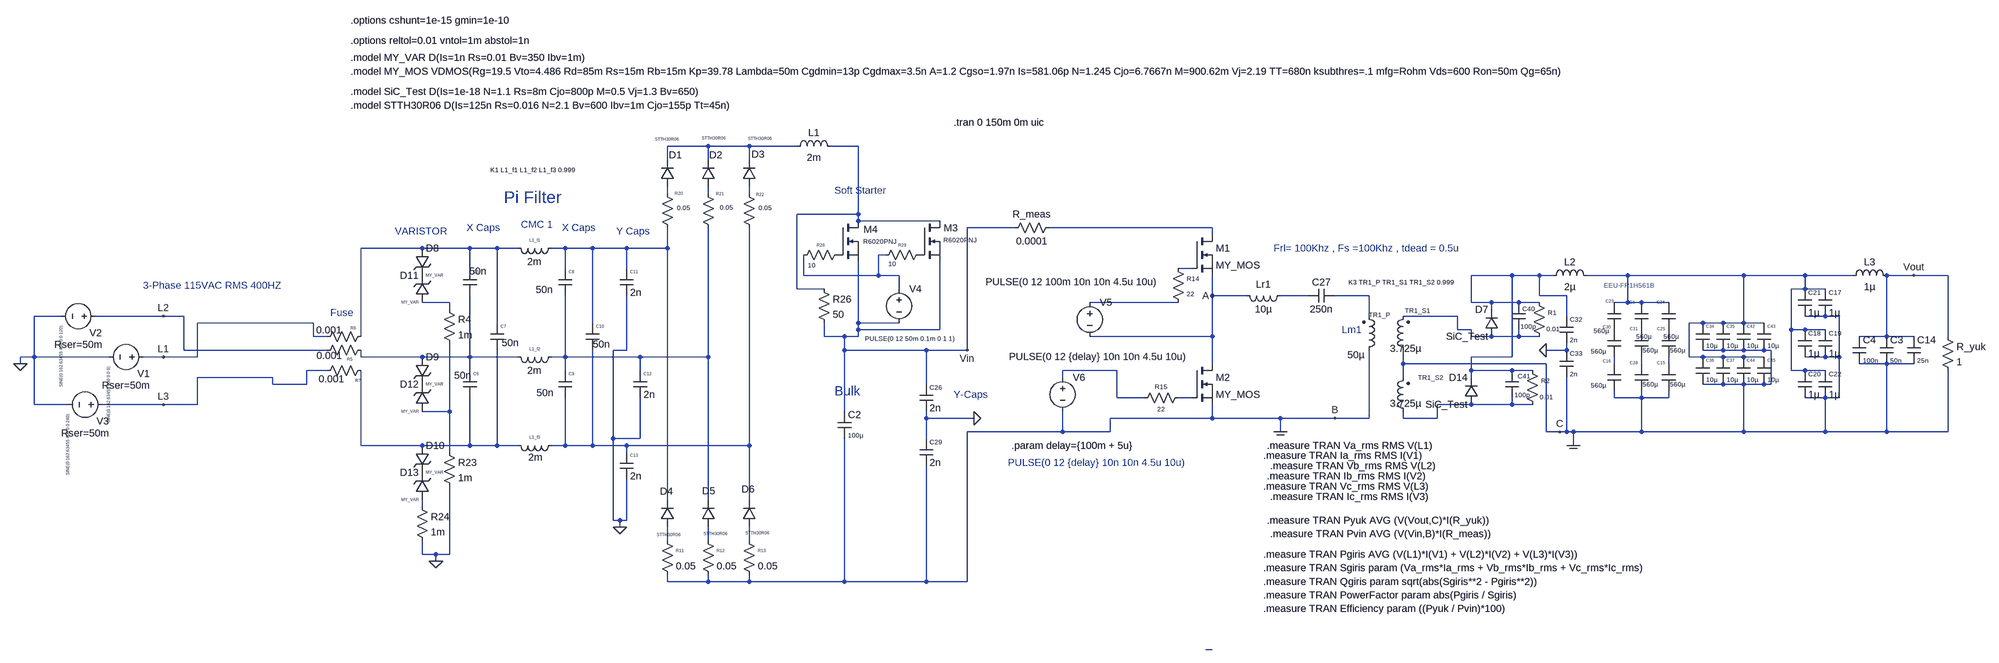
[diagram p0: schematic Sim.asc]
Sim.asc, the LTspice schematic file:
Version 4.1
SHEET 1 5288 1360
WIRE 1616 -672 1520 -672
WIRE 1712 -672 1616 -672
WIRE 1824 -672 1712 -672
WIRE 1968 -672 1904 -672
WIRE 1520 -640 1520 -672
WIRE 1616 -640 1616 -672
WIRE 1712 -640 1712 -672
WIRE 1520 -560 1520 -576
WIRE 1616 -560 1616 -576
WIRE 1712 -560 1712 -576
WIRE 1968 -512 1968 -672
WIRE 1968 -512 1824 -512
WIRE 1968 -496 1968 -512
WIRE 2160 -496 1968 -496
WIRE 2336 -480 2224 -480
WIRE 2800 -480 2416 -480
WIRE 2800 -464 2800 -480
WIRE 944 -432 800 -432
WIRE 1056 -432 944 -432
WIRE 1120 -432 1056 -432
WIRE 1168 -432 1120 -432
WIRE 1280 -432 1248 -432
WIRE 1344 -432 1280 -432
WIRE 1424 -432 1344 -432
WIRE 1520 -432 1520 -480
WIRE 1520 -432 1424 -432
WIRE 2032 -416 2016 -416
WIRE 1056 -384 1056 -432
WIRE 1280 -384 1280 -432
WIRE 1424 -384 1424 -432
WIRE 2752 -384 2720 -384
WIRE 1840 -368 1840 -416
WIRE 2016 -368 2016 -416
WIRE 2016 -368 1840 -368
WIRE 2064 -368 2016 -368
WIRE 3504 -368 3408 -368
WIRE 3568 -368 3504 -368
WIRE 3600 -368 3568 -368
WIRE 3776 -368 3680 -368
WIRE 4048 -368 3776 -368
WIRE 4192 -368 4048 -368
WIRE 4304 -368 4192 -368
WIRE 4448 -368 4384 -368
WIRE 4528 -368 4448 -368
WIRE 1824 -336 1824 -512
WIRE 1888 -336 1824 -336
WIRE 2064 -336 2064 -368
WIRE 4192 -336 4192 -368
WIRE 4192 -336 4160 -336
WIRE 4240 -336 4192 -336
WIRE 2800 -320 2800 -368
WIRE 2880 -320 2800 -320
WIRE 3024 -320 2960 -320
WIRE 3168 -320 3088 -320
WIRE 3568 -320 3568 -368
WIRE 3632 -320 3568 -320
WIRE 1008 -304 944 -304
WIRE 2720 -304 2512 -304
WIRE 3408 -304 3408 -368
WIRE 3456 -304 3408 -304
WIRE 3520 -304 3456 -304
WIRE 3568 -304 3520 -304
WIRE 3776 -304 3776 -368
WIRE 3776 -304 3744 -304
WIRE 3808 -304 3776 -304
WIRE 3872 -304 3808 -304
WIRE 1008 -288 1008 -304
WIRE 3456 -288 3456 -304
WIRE 96 -272 32 -272
WIRE 336 -272 176 -272
WIRE 384 -272 336 -272
WIRE 3168 -272 3168 -320
WIRE 3376 -272 3248 -272
WIRE 3632 -272 3632 -320
WIRE 4240 -272 4192 -272
WIRE 4272 -272 4240 -272
WIRE 688 -256 416 -256
WIRE 1120 -256 1120 -432
WIRE 1344 -256 1344 -432
WIRE 1968 -256 1968 -400
WIRE 2064 -256 1968 -256
WIRE 3952 -256 3920 -256
WIRE 4000 -256 3952 -256
WIRE 4048 -256 4048 -368
WIRE 4048 -256 4000 -256
WIRE 4096 -256 4048 -256
WIRE 1968 -240 1968 -256
WIRE 2160 -240 2160 -400
WIRE 2160 -240 1968 -240
WIRE 3376 -240 3376 -272
WIRE 3408 -240 3376 -240
WIRE 4160 -240 4160 -336
WIRE 4192 -240 4160 -240
WIRE 4240 -240 4192 -240
WIRE 688 -224 688 -256
WIRE 720 -224 688 -224
WIRE 800 -224 800 -432
WIRE 1888 -224 1888 -256
WIRE 1936 -224 1888 -224
WIRE 1968 -224 1968 -240
WIRE 1968 -224 1936 -224
WIRE 2800 -224 2800 -320
WIRE 2800 -224 2512 -224
WIRE 3408 -224 3408 -240
WIRE 3456 -224 3408 -224
WIRE 3520 -224 3520 -240
WIRE 3520 -224 3456 -224
WIRE 3568 -224 3520 -224
WIRE 4384 -224 4384 -368
WIRE 4384 -224 4320 -224
WIRE 4448 -224 4384 -224
WIRE 4528 -224 4528 -368
WIRE 384 -192 384 -272
WIRE 720 -192 384 -192
WIRE 1424 -192 1424 -320
WIRE 1424 -192 1392 -192
WIRE 1936 -192 1936 -224
WIRE 2128 -192 1936 -192
WIRE 2224 -192 2224 -480
WIRE 2224 -192 2128 -192
WIRE 3632 -192 3632 -208
WIRE 3632 -192 3584 -192
WIRE 4000 -192 3952 -192
WIRE 4048 -192 4000 -192
WIRE 4096 -192 4048 -192
WIRE 4112 -192 4096 -192
WIRE 32 -176 32 -272
WIRE 32 -176 0 -176
WIRE 208 -176 32 -176
WIRE 336 -176 288 -176
WIRE 416 -176 416 -256
WIRE 416 -176 336 -176
WIRE 800 -176 800 -192
WIRE 944 -176 800 -176
WIRE 1056 -176 1056 -320
WIRE 1056 -176 944 -176
WIRE 1168 -176 1056 -176
WIRE 1280 -176 1280 -320
WIRE 1280 -176 1248 -176
WIRE 1456 -176 1280 -176
WIRE 1616 -176 1616 -480
WIRE 1616 -176 1456 -176
WIRE 3504 -176 3504 -368
WIRE 3504 -176 3408 -176
WIRE 3920 -176 3920 -256
WIRE 3952 -176 3920 -176
WIRE 4000 -176 3952 -176
WIRE 4048 -176 4000 -176
WIRE 4096 -176 4048 -176
WIRE 4240 -176 4192 -176
WIRE 4272 -176 4272 -272
WIRE 4272 -176 4240 -176
WIRE 0 -160 0 -176
WIRE 2800 -160 2800 -224
WIRE 3248 -160 3248 -192
WIRE 3584 -160 3248 -160
WIRE 3744 -160 3744 -176
WIRE 3808 -160 3808 -176
WIRE 3872 -160 3872 -176
WIRE 4384 -160 4320 -160
WIRE 4448 -160 4384 -160
WIRE 720 -144 672 -144
WIRE 1056 -144 1056 -176
WIRE 1280 -144 1280 -176
WIRE 1456 -144 1456 -176
WIRE 2576 -144 2448 -144
WIRE 3408 -144 3408 -176
WIRE 3504 -144 3408 -144
WIRE 3552 -144 3504 -144
WIRE 4160 -144 4160 -240
WIRE 4192 -144 4160 -144
WIRE 4240 -144 4192 -144
WIRE 592 -128 416 -128
WIRE 2448 -128 2448 -144
WIRE 3248 -128 3248 -160
WIRE 3408 -128 3408 -144
WIRE 592 -112 592 -128
WIRE 672 -112 672 -144
WIRE 672 -112 592 -112
WIRE 2128 -112 2128 -192
WIRE 4000 -112 3952 -112
WIRE 4048 -112 4000 -112
WIRE 4096 -112 4048 -112
WIRE 4112 -112 4112 -192
WIRE 4112 -112 4096 -112
WIRE 2576 -80 2576 -144
WIRE 2640 -80 2576 -80
WIRE 2752 -80 2720 -80
WIRE 3744 -80 3744 -96
WIRE 3808 -80 3808 -96
WIRE 3808 -80 3744 -80
WIRE 3872 -80 3872 -96
WIRE 3872 -80 3808 -80
WIRE 4240 -80 4192 -80
WIRE 4272 -80 4272 -176
WIRE 4272 -80 4240 -80
WIRE 32 -64 32 -176
WIRE 112 -64 32 -64
WIRE 336 -64 192 -64
WIRE 416 -64 416 -128
WIRE 416 -64 336 -64
WIRE 3408 -64 3328 -64
WIRE 3504 -64 3504 -80
WIRE 3504 -64 3408 -64
WIRE 3552 -64 3504 -64
WIRE 1008 -48 1008 -208
WIRE 1008 -48 944 -48
WIRE 1936 -48 1936 -192
WIRE 2128 -32 2128 -48
WIRE 2240 -32 2128 -32
WIRE 2800 -32 2800 -64
WIRE 2800 -32 2560 -32
WIRE 2960 -32 2800 -32
WIRE 3088 -32 2960 -32
WIRE 3168 -32 3168 -192
WIRE 3168 -32 3088 -32
WIRE 3248 -32 3248 -48
WIRE 3328 -32 3328 -64
WIRE 3328 -32 3248 -32
WIRE 2448 0 2448 -48
WIRE 2448 0 2224 0
WIRE 2560 0 2560 -32
WIRE 2560 0 2448 0
WIRE 2960 0 2960 -32
WIRE 3584 0 3584 -160
WIRE 3616 0 3584 0
WIRE 3632 0 3632 -128
WIRE 3632 0 3616 0
WIRE 3648 0 3632 0
WIRE 3808 0 3808 -80
WIRE 3808 0 3648 0
WIRE 4048 0 4048 -112
WIRE 4048 0 3808 0
WIRE 4240 0 4240 -80
WIRE 4240 0 4048 0
WIRE 4384 0 4384 -160
WIRE 4384 0 4240 0
WIRE 4528 0 4528 -144
WIRE 4528 0 4384 0
WIRE 1392 16 1392 -192
WIRE 1456 16 1456 -80
WIRE 1456 16 1392 16
WIRE 2128 16 2128 -32
WIRE 800 32 800 -144
WIRE 944 32 800 32
WIRE 1056 32 1056 -80
WIRE 1056 32 944 32
WIRE 1120 32 1120 -192
WIRE 1120 32 1056 32
WIRE 1168 32 1120 32
WIRE 1280 32 1280 -80
WIRE 1280 32 1248 32
WIRE 1344 32 1344 -192
WIRE 1344 32 1280 32
WIRE 1424 32 1344 32
WIRE 1712 32 1712 -480
WIRE 1712 32 1424 32
WIRE 3648 32 3648 0
WIRE 1008 48 1008 -48
WIRE 1424 48 1424 32
WIRE 1520 160 1520 -432
WIRE 1616 160 1616 -176
WIRE 1712 160 1712 32
WIRE 944 176 944 160
WIRE 1392 208 1392 16
WIRE 1408 208 1392 208
WIRE 1424 208 1424 112
WIRE 1424 208 1408 208
WIRE 1408 224 1408 208
WIRE 1520 256 1520 224
WIRE 1616 256 1616 224
WIRE 1712 256 1712 224
WIRE 944 288 944 256
WIRE 976 288 944 288
WIRE 1008 288 1008 128
WIRE 1008 288 976 288
WIRE 976 304 976 288
WIRE 1520 352 1520 336
WIRE 1616 352 1616 336
WIRE 1616 352 1520 352
WIRE 1712 352 1712 336
WIRE 1712 352 1616 352
WIRE 1936 352 1936 16
WIRE 1936 352 1712 352
WIRE 2128 352 2128 80
WIRE 2128 352 1936 352
WIRE 2224 352 2224 0
WIRE 2224 352 2128 352
WIRE 2800 512 2784 512
FLAG 976 304 0
FLAG 1408 224 0
FLAG 0 -160 0
FLAG 2800 -320 A
FLAG 3088 -32 B
FLAG 3648 32 COM
FLAG 4448 -368 Vout
FLAG 2224 -192 Vin
FLAG 2960 0 COM
FLAG 3616 0 C
FLAG 336 -176 L1
FLAG 336 -272 L2
FLAG 336 -64 L3
FLAG 2240 -32 0
FLAG 3584 -192 0
SYMBOL voltage 304 -176 R90
WINDOW 123 0 0 Left 0
WINDOW 39 67 0 VRight 2
WINDOW 0 39 0 VRight 2
WINDOW 3 24 96 Left 0
SYMATTR SpiceLine Rser=50m
SYMATTR InstName V1
SYMATTR Value SINE(0 162.63455 400 0 0 0)
SYMBOL voltage 192 -272 R90
WINDOW 123 0 0 Left 0
WINDOW 39 67 0 VRight 2
WINDOW 0 39 0 VRight 2
WINDOW 3 24 96 Left 0
SYMATTR SpiceLine Rser=50m
SYMATTR InstName V2
SYMATTR Value SINE(0 162.63455 400 0 0 120)
SYMBOL voltage 208 -64 R90
WINDOW 123 0 0 Left 0
WINDOW 39 67 0 VRight 2
WINDOW 0 39 0 VRight 2
WINDOW 3 24 96 Left 0
SYMATTR SpiceLine Rser=50m
SYMATTR InstName V3
SYMATTR Value SINE(0 162.63455 400 0 0 240)
SYMBOL diode 1536 -576 R180
WINDOW 0 -18 75 Left 2
WINDOW 3 -11 112 Left 0
SYMATTR InstName D1
SYMATTR Value STTH30R06
SYMBOL diode 1632 -576 R180
WINDOW 0 -17 75 Left 2
WINDOW 3 -25 114 Left 0
SYMATTR InstName D2
SYMATTR Value STTH30R06
SYMBOL diode 1728 -576 R180
WINDOW 0 -20 77 Left 2
WINDOW 3 -37 113 Left 0
SYMATTR InstName D3
SYMATTR Value STTH30R06
SYMBOL diode 1536 224 R180
WINDOW 0 3 84 Left 2
WINDOW 3 -15 -18 Left 0
SYMATTR InstName D4
SYMATTR Value STTH30R06
SYMBOL diode 1632 224 R180
WINDOW 0 0 85 Left 2
WINDOW 3 -29 -16 Left 0
SYMATTR InstName D5
SYMATTR Value STTH30R06
SYMBOL diode 1728 224 R180
WINDOW 0 3 89 Left 2
WINDOW 3 -31 -14 Left 0
SYMATTR InstName D6
SYMATTR Value STTH30R06
SYMBOL res 816 -240 R90
WINDOW 0 76 42 VBottom 0
WINDOW 3 -15 91 VTop 2
SYMATTR InstName R5
SYMATTR Value 0.001
SYMBOL res 704 -176 R270
WINDOW 0 61 78 VTop 0
WINDOW 3 19 22 VBottom 2
SYMATTR InstName R6
SYMATTR Value 0.001
SYMBOL res 816 -160 R90
WINDOW 0 46 23 VBottom 0
WINDOW 3 20 85 VTop 2
SYMATTR InstName R7
SYMATTR Value 0.001
SYMBOL res 1504 240 R0
WINDOW 0 36 40 Left 0
SYMATTR InstName R11
SYMATTR Value 0.05
SYMBOL res 1600 240 R0
WINDOW 0 36 40 Left 0
SYMATTR InstName R12
SYMATTR Value 0.05
SYMBOL res 1696 240 R0
WINDOW 0 36 40 Left 0
SYMATTR InstName R13
SYMATTR Value 0.05
SYMBOL zener 928 -432 R0
WINDOW 3 24 64 Left 0
SYMATTR Value MY_VAR
SYMATTR InstName D8
SYMBOL zener 928 -176 R0
WINDOW 3 24 64 Left 0
SYMATTR Value MY_VAR
SYMATTR InstName D9
SYMBOL zener 928 32 R0
WINDOW 3 24 64 Left 0
SYMATTR Value MY_VAR
SYMATTR InstName D10
SYMBOL zener 960 -304 R180
WINDOW 0 24 64 Left 2
WINDOW 3 24 0 Left 0
SYMATTR InstName D11
SYMATTR Value MY_VAR
SYMBOL zener 960 -48 R180
WINDOW 0 24 64 Left 2
WINDOW 3 24 0 Left 0
SYMATTR InstName D12
SYMATTR Value MY_VAR
SYMBOL zener 960 160 R180
WINDOW 0 24 64 Left 2
WINDOW 3 24 0 Left 0
SYMATTR InstName D13
SYMATTR Value MY_VAR
SYMBOL ind 1264 -448 R90
WINDOW 0 4 56 VBottom 0
WINDOW 3 32 56 VTop 2
SYMATTR InstName L1_f1
SYMATTR Value 2m
SYMATTR Type ind
SYMATTR SpiceLine Rser=1m
SYMBOL ind 1264 -192 R90
WINDOW 0 4 56 VBottom 0
WINDOW 3 32 56 VTop 2
SYMATTR InstName L1_f2
SYMATTR Value 2m
SYMATTR Type ind
SYMATTR SpiceLine Rser=1m
SYMBOL ind 1264 16 R90
WINDOW 0 4 56 VBottom 0
WINDOW 3 28 54 VTop 2
SYMATTR InstName L1_f3
SYMATTR Value 2m
SYMATTR Type ind
SYMATTR SpiceLine Rser=1m
SYMBOL cap 1040 -384 R0
WINDOW 0 24 8 Left 0
WINDOW 3 15 6 Left 2
SYMATTR InstName C5
SYMATTR Value 50n
SYMATTR SpiceLine Rser=0.01m
SYMBOL cap 1040 -144 R0
WINDOW 0 24 8 Left 0
WINDOW 3 -21 11 Left 2
SYMATTR InstName C6
SYMATTR Value 50n
SYMATTR SpiceLine Rser=0.01m
SYMBOL cap 1104 -256 R0
WINDOW 0 24 8 Left 0
WINDOW 3 27 47 Left 2
SYMATTR InstName C7
SYMATTR Value 50n
SYMATTR SpiceLine Rser=0.01m
SYMBOL cap 1264 -384 R0
WINDOW 0 24 8 Left 0
WINDOW 3 -53 50 Left 2
SYMATTR InstName C8
SYMATTR Value 50n
SYMATTR SpiceLine Rser=0.01m
SYMBOL cap 1264 -144 R0
WINDOW 0 24 8 Left 0
WINDOW 3 -52 52 Left 2
SYMATTR InstName C9
SYMATTR Value 50n
SYMATTR SpiceLine Rser=0.01m
SYMBOL cap 1328 -256 R0
WINDOW 0 24 8 Left 0
WINDOW 3 17 50 Left 2
SYMATTR InstName C10
SYMATTR Value 50n
SYMATTR SpiceLine Rser=0.01m
SYMBOL cap 1408 -384 R0
WINDOW 0 24 8 Left 0
SYMATTR InstName C11
SYMATTR Value 2n
SYMATTR SpiceLine Rser=0.001m
SYMBOL cap 1440 -144 R0
WINDOW 0 24 8 Left 0
SYMATTR InstName C12
SYMATTR Value 2n
SYMATTR SpiceLine Rser=0.001m
SYMBOL cap 1408 48 R0
WINDOW 0 24 8 Left 0
SYMATTR InstName C13
SYMATTR Value 2n
SYMATTR SpiceLine Rser=0.001m
SYMBOL res 1504 -576 R0
WINDOW 0 33 16 Left 0
WINDOW 3 38 49 Left 1
SYMATTR InstName R20
SYMATTR Value 0.05
SYMBOL res 1600 -576 R0
WINDOW 0 34 17 Left 0
WINDOW 3 43 48 Left 1
SYMATTR InstName R21
SYMATTR Value 0.05
SYMBOL res 1696 -576 R0
WINDOW 0 32 18 Left 0
WINDOW 3 38 49 Left 1
SYMATTR InstName R22
SYMATTR Value 0.05
SYMBOL res 992 -304 R0
SYMATTR InstName R4
SYMATTR Value 1m
SYMBOL res 992 32 R0
SYMATTR InstName R23
SYMATTR Value 1m
SYMBOL res 928 160 R0
SYMATTR InstName R24
SYMATTR Value 1m
SYMBOL res 1936 -432 R90
WINDOW 0 0 56 VBottom 0
WINDOW 3 30 77 VTop 1
SYMATTR InstName R28
SYMATTR Value 10
SYMBOL res 2128 -432 R90
WINDOW 0 0 56 VBottom 0
WINDOW 3 26 80 VTop 1
SYMATTR InstName R29
SYMATTR Value 10
SYMBOL voltage 2064 -352 R0
WINDOW 3 -80 133 Left 1
WINDOW 123 0 0 Left 0
WINDOW 39 0 0 Left 0
SYMATTR Value PULSE(0 12 50m 0.1m 0 1 1)
SYMATTR InstName V4
SYMBOL res 1872 -352 R0
SYMATTR InstName R26
SYMATTR Value 50
SYMBOL ind 2976 -336 R90
WINDOW 0 5 56 VBottom 2
WINDOW 3 32 56 VTop 2
SYMATTR InstName Lr1
SYMATTR Value 10µ
SYMATTR SpiceLine Rser=0.01m
SYMBOL cap 3088 -336 R90
WINDOW 0 0 32 VBottom 2
WINDOW 3 32 32 VTop 2
SYMATTR InstName C27
SYMATTR Value 250n
SYMATTR SpiceLine Rser=0.01m
SYMBOL ind2 3152 -176 M180
WINDOW 0 15 99 Left 1
WINDOW 3 -35 5 Left 2
SYMATTR InstName TR1_P
SYMATTR Value 50µ
SYMATTR Type ind
SYMATTR SpiceLine Rser=0.01m
SYMBOL ind2 3264 -176 R180
WINDOW 0 -47 109 Left 1
WINDOW 3 -28 20 Left 2
SYMATTR InstName TR1_S1
SYMATTR Value 3.725µ
SYMATTR Type ind
SYMATTR SpiceLine Rser=1m
SYMBOL cap 3792 -160 R0
WINDOW 0 -11 -2 Left 0
WINDOW 3 19 48 Left 1
SYMATTR InstName C28
SYMATTR Value 560µ
SYMATTR SpiceLine V=50 Rser=15m Lser=10n
SYMBOL res 4512 -240 R0
SYMATTR InstName R_yuk
SYMATTR Value 1
SYMBOL ind2 3264 -32 R180
WINDOW 0 -78 96 Left 1
WINDOW 3 -28 35 Left 2
SYMATTR InstName TR1_S2
SYMATTR Value 3.725µ
SYMATTR Type ind
SYMATTR SpiceLine Rser=1m
SYMBOL res 2704 -400 R0
WINDOW 0 36 40 Left 1
WINDOW 3 36 76 Left 1
SYMATTR InstName R14
SYMATTR Value 22
SYMBOL res 2736 -96 R90
WINDOW 0 0 56 VBottom 1
WINDOW 3 32 56 VTop 1
SYMATTR InstName R15
SYMATTR Value 22
SYMBOL nmos 2752 -464 R0
SYMATTR InstName M1
SYMATTR Value MY_MOS
SYMBOL nmos 2752 -160 R0
SYMATTR InstName M2
SYMATTR Value MY_MOS
SYMBOL nmos 2112 -496 R0
WINDOW 0 57 17 Left 2
WINDOW 3 56 45 Left 1
SYMATTR InstName M3
SYMATTR Value R6020PNJ
SYMBOL nmos 1920 -496 R0
WINDOW 0 61 20 Left 2
WINDOW 3 60 48 Left 1
SYMATTR InstName M4
SYMATTR Value R6020PNJ
SYMBOL cap 3792 -304 R0
WINDOW 0 -12 0 Left 0
WINDOW 3 4 80 Left 1
SYMATTR InstName C1
SYMATTR Value 560µ
SYMATTR SpiceLine V=50 Rser=15m Lser=10n
SYMBOL cap 3728 -160 R0
WINDOW 0 -11 -6 Left 0
WINDOW 3 -39 51 Left 1
SYMATTR InstName C16
SYMATTR Value 560µ
SYMATTR SpiceLine V=50 Rser=15m Lser=10n
SYMBOL cap 3728 -304 R0
WINDOW 0 -4 -3 Left 0
WINDOW 3 -32 66 Left 1
SYMATTR InstName C23
SYMATTR Value 560µ
SYMATTR SpiceLine V=50 Rser=15m Lser=10n
SYMBOL cap 3936 -256 R0
WINDOW 0 24 8 Left 0
WINDOW 3 24 53 Left 1
SYMATTR InstName C34
SYMATTR Value 10µ
SYMATTR SpiceLine Rser=1m Lser=0.1n
SYMBOL cap 3984 -256 R0
WINDOW 0 24 8 Left 0
WINDOW 3 24 53 Left 1
SYMATTR InstName C35
SYMATTR Value 10µ
SYMATTR SpiceLine Rser=1m Lser=0.1n
SYMBOL cap 3936 -176 R0
WINDOW 0 24 8 Left 0
WINDOW 3 24 53 Left 1
SYMATTR InstName C36
SYMATTR Value 10µ
SYMATTR SpiceLine Rser=1m Lser=0.1n
SYMBOL cap 3984 -176 R0
WINDOW 0 24 8 Left 0
WINDOW 3 24 53 Left 1
SYMATTR InstName C37
SYMATTR Value 10µ
SYMATTR SpiceLine Rser=1m Lser=0.1n
SYMBOL cap 3504 -304 R0
WINDOW 0 24 15 Left 1
WINDOW 3 20 56 Left 1
SYMATTR InstName C40
SYMATTR Value 100p
SYMBOL cap 3488 -144 R0
WINDOW 0 29 13 Left 1
WINDOW 3 22 57 Left 1
SYMATTR InstName C41
SYMATTR Value 100p
SYMBOL diode 3472 -224 R180
WINDOW 0 24 64 Left 2
WINDOW 3 24 0 Left 2
SYMATTR InstName D7
SYMATTR Value SiC_Test
SYMBOL diode 3424 -64 R180
WINDOW 0 24 64 Left 2
WINDOW 3 24 0 Left 2
SYMATTR InstName D14
SYMATTR Value SiC_Test
SYMBOL cap 4032 -256 R0
WINDOW 0 24 8 Left 0
WINDOW 3 24 53 Left 1
SYMATTR InstName C42
SYMATTR Value 10µ
SYMATTR SpiceLine Rser=1m Lser=0.1n
SYMBOL cap 4080 -256 R0
WINDOW 0 24 8 Left 0
WINDOW 3 24 53 Left 1
SYMATTR InstName C43
SYMATTR Value 10µ
SYMATTR SpiceLine Rser=1m Lser=0.1n
SYMBOL cap 4032 -176 R0
WINDOW 0 24 8 Left 0
WINDOW 3 24 53 Left 1
SYMATTR InstName C44
SYMATTR Value 10µ
SYMATTR SpiceLine Rser=1m Lser=0.1n
SYMBOL cap 4080 -176 R0
WINDOW 0 24 8 Left 0
WINDOW 3 24 53 Left 1
SYMATTR InstName C45
SYMATTR Value 10µ
SYMATTR SpiceLine Rser=1m Lser=0.1n
SYMBOL cap 3728 -240 R0
WINDOW 0 -11 -6 Left 0
WINDOW 3 -39 51 Left 1
SYMATTR InstName C30
SYMATTR Value 560µ
SYMATTR SpiceLine V=50 Rser=15m Lser=10n
SYMBOL cap 3792 -240 R0
WINDOW 0 -11 -2 Left 0
WINDOW 3 19 48 Left 1
SYMATTR InstName C31
SYMATTR Value 560µ
SYMATTR SpiceLine V=50 Rser=15m Lser=10n
SYMBOL cap 1920 -48 R0
WINDOW 3 24 56 Left 1
SYMATTR Value 100µ
SYMATTR InstName C2
SYMATTR SpiceLine V=450 Rser=10m
SYMBOL ind 1808 -656 R270
WINDOW 0 32 56 VTop 2
WINDOW 3 5 56 VBottom 2
SYMATTR InstName L1
SYMATTR Value 2m
SYMATTR SpiceLine Rser=50m
SYMBOL voltage 2512 -320 R0
WINDOW 3 -245 -33 Left 2
WINDOW 123 0 0 Left 0
WINDOW 39 0 0 Left 0
SYMATTR Value PULSE(0 12 100m 10n 10n 4.5u 10u)
SYMATTR InstName V5
SYMBOL voltage 2448 -144 R0
WINDOW 3 -126 -33 Left 2
WINDOW 123 0 0 Left 0
WINDOW 39 0 0 Left 0
SYMATTR Value PULSE(0 12 {delay} 10n 10n 4.5u 10u)
SYMATTR InstName V6
SYMBOL cap 4176 -336 R0
WINDOW 0 24 8 Left 1
SYMATTR InstName C21
SYMATTR Value 1µ
SYMATTR SpiceLine Rser=1m
SYMBOL cap 4224 -336 R0
WINDOW 0 24 8 Left 1
SYMATTR InstName C17
SYMATTR Value 1µ
SYMATTR SpiceLine Rser=1m
SYMBOL cap 4176 -240 R0
WINDOW 0 24 8 Left 1
SYMATTR InstName C18
SYMATTR Value 1µ
SYMATTR SpiceLine Rser=1m
SYMBOL cap 4224 -240 R0
WINDOW 0 24 8 Left 1
SYMATTR InstName C19
SYMATTR Value 1µ
SYMATTR SpiceLine Rser=1m
SYMBOL cap 4176 -144 R0
WINDOW 0 24 8 Left 1
SYMATTR InstName C20
SYMATTR Value 1µ
SYMATTR SpiceLine Rser=1m
SYMBOL cap 4224 -144 R0
WINDOW 0 24 8 Left 1
SYMATTR InstName C22
SYMATTR Value 1µ
SYMATTR SpiceLine Rser=1m
SYMBOL ind 3584 -352 R270
WINDOW 0 32 56 VTop 2
WINDOW 3 5 56 VBottom 2
SYMATTR InstName L2
SYMATTR Value 2µ
SYMATTR SpiceLine Rser=40m
SYMBOL res 2320 -464 R270
WINDOW 0 32 56 VTop 2
WINDOW 3 0 56 VBottom 2
SYMATTR InstName R_meas
SYMATTR Value 0.0001
SYMBOL cap 3856 -160 R0
WINDOW 0 -11 -2 Left 0
WINDOW 3 19 48 Left 1
SYMATTR InstName C15
SYMATTR Value 560µ
SYMATTR SpiceLine V=50 Rser=15m Lser=10n
SYMBOL cap 3856 -304 R0
WINDOW 0 -12 0 Left 0
WINDOW 3 4 80 Left 1
SYMATTR InstName C24
SYMATTR Value 560µ
SYMATTR SpiceLine V=50 Rser=15m Lser=10n
SYMBOL cap 3856 -240 R0
WINDOW 0 -11 -2 Left 0
WINDOW 3 19 48 Left 1
SYMATTR InstName C25
SYMATTR Value 560µ
SYMATTR SpiceLine V=50 Rser=15m Lser=10n
SYMBOL ind 4288 -352 R270
WINDOW 0 32 56 VTop 2
WINDOW 3 5 56 VBottom 2
SYMATTR InstName L3
SYMATTR Value 1µ
SYMATTR SpiceLine Rser=1m
SYMBOL cap 4368 -224 R0
WINDOW 3 24 56 Left 1
SYMATTR Value 50n
SYMATTR InstName C3
SYMATTR SpiceLine Rser=0.01m
SYMBOL cap 4304 -224 R0
WINDOW 3 24 56 Left 1
SYMATTR Value 100n
SYMATTR InstName C4
SYMATTR SpiceLine Rser=0.01m
SYMBOL cap 4432 -224 R0
WINDOW 3 24 56 Left 1
SYMATTR Value 25n
SYMATTR InstName C14
SYMATTR SpiceLine Rser=0.01m
SYMBOL cap 2112 -112 R0
WINDOW 0 24 8 Left 1
SYMATTR InstName C26
SYMATTR Value 2n
SYMBOL cap 2112 16 R0
WINDOW 0 24 8 Left 1
SYMATTR InstName C29
SYMATTR Value 2n
SYMBOL cap 3616 -272 R0
WINDOW 0 24 8 Left 1
WINDOW 3 24 56 Left 1
SYMATTR InstName C32
SYMATTR Value 2n
SYMBOL cap 3616 -192 R0
WINDOW 0 24 8 Left 1
WINDOW 3 24 56 Left 1
SYMATTR InstName C33
SYMATTR Value 2n
SYMBOL res 3552 -320 R0
WINDOW 0 36 40 Left 1
WINDOW 3 33 78 Left 1
SYMATTR InstName R1
SYMATTR Value 0.01
SYMBOL res 3536 -160 R0
WINDOW 0 36 40 Left 1
WINDOW 3 33 78 Left 1
SYMATTR InstName R2
SYMATTR Value 0.01
TEXT 728 -280 Left 2 ;Fuse
TEXT 288 -344 Left 2 ;3-Phase 115VAC RMS 400HZ
TEXT 776 -880 Left 2 !.model MY_VAR D(Is=1n Rs=0.01 Bv=350 Ibv=1m)
TEXT 880 -472 Left 2 ;VARISTOR
TEXT 2192 -728 Left 2 !.tran 0 150m 0m uic
TEXT 1104 -616 Left 1 !K1 L1_f1 L1_f2 L1_f3 0.999
TEXT 1176 -488 Left 2 ;CMC 1
TEXT 1048 -480 Left 2 ;X Caps
TEXT 1272 -480 Left 2 ;X Caps
TEXT 1400 -472 Left 2 ;Y Caps
TEXT 1136 -552 Left 4 ;Pi Filter
TEXT 3120 -352 Left 1 !K3 TR1_P TR1_S1 TR1_S2 0.999
TEXT 776 -968 Left 2 !.options cshunt=1e-15 gmin=1e-10
TEXT 776 -920 Left 2 !.options reltol=0.01 vntol=1m abstol=1n
TEXT 1912 -568 Left 2 ;Soft Starter
TEXT 3104 -240 Left 2 ;Lm1
TEXT 2944 -432 Left 2 ;Frl= 100Khz , Fs =100Khz , tdead = 0.5u
TEXT 2328 32 Left 2 !.param delay={100m + 5u}
TEXT 2920 288 Left 2 !.measure TRAN Pgiris AVG (V(L1)*I(V1) + V(L2)*I(V2) + V(L3)*I(V3))
TEXT 2928 32 Left 2 !.measure TRAN Va_rms RMS V(L1)
TEXT 2920 56 Left 2 !.measure TRAN Ia_rms RMS I(V1)
TEXT 2936 80 Left 2 !.measure TRAN Vb_rms RMS V(L2)
TEXT 2928 104 Left 2 !.measure TRAN Ib_rms RMS I(V2)
TEXT 2920 128 Left 2 !.measure TRAN Vc_rms RMS V(L3)
TEXT 2936 152 Left 2 !.measure TRAN Ic_rms RMS I(V3)
TEXT 2920 320 Left 2 !.measure TRAN Sgiris param (Va_rms*Ia_rms + Vb_rms*Ib_rms + Vc_rms*Ic_rms)
TEXT 2920 352 Left 2 !.measure TRAN Qgiris param sqrt(abs(Sgiris**2 - Pgiris**2))
TEXT 2920 384 Left 2 !.measure TRAN PowerFactor param abs(Pgiris / Sgiris)
TEXT 776 -800 Left 2 !.model SiC_Test D(Is=1e-18 N=1.1 Rs=8m Cjo=800p M=0.5 Vj=1.3 Bv=650)
TEXT 3720 -344 Left 1 ;EEU-FR1H561B
TEXT 776 -848 Left 2 !.model MY_MOS VDMOS(Rg=19.5 Vto=4.486 Rd=85m Rs=15m Rb=15m Kp=39.78 Lambda=50m Cgdmin=13p Cgdmax=3.5n A=1.2 Cgso=1.97n Is=581.06p N=1.245 Cjo=6.7667n M=900.62m Vj=2.19 TT=680n ksubthres=.1 mfg=Rohm Vds=600 Ron=50m Qg=65n)
TEXT 2320 72 Left 2 ;PULSE(0 12 {delay} 10n 10n 4.5u 10u)
TEXT 2928 208 Left 2 !.measure TRAN Pyuk AVG (V(Vout,C)*I(R_yuk))
TEXT 2920 416 Left 2 !.measure TRAN Efficiency param ((Pyuk / Pvin)*100)
TEXT 2936 240 Left 2 !.measure TRAN Pvin AVG (V(Vin,B)*I(R_meas))
TEXT 1912 -96 Left 3 ;Bulk
TEXT 776 -768 Left 2 !.model STTH30R06 D(Is=125n Rs=0.016 N=2.1 Bv=600 Ibv=1m Cjo=155p Tt=45n)
TEXT 2192 -88 Left 2 ;Y-Caps

The netlist it stands for:
* Sim.asc
V1 L1 0 SINE(0 162.63455 400 0 0 0) Rser=50m
V2 L2 0 SINE(0 162.63455 400 0 0 120) Rser=50m
V3 L3 0 SINE(0 162.63455 400 0 0 240) Rser=50m
D1 N003 N001 STTH30R06
D2 N004 N001 STTH30R06
D3 N005 N001 STTH30R06
D4 N030 N008 STTH30R06
D5 N031 N019 STTH30R06
D6 N032 N028 STTH30R06
R5 N007 L1 0.001
R6 L2 N018 0.001
R7 N027 L3 0.001
R11 N030 C 0.05
R12 N031 C 0.05
R13 N032 C 0.05
D8 N007 P001 MY_VAR
D9 N018 P002 MY_VAR
D10 N027 P003 MY_VAR
D11 N015 P001 MY_VAR
D12 N026 P002 MY_VAR
D13 N029 P003 MY_VAR
L1_f1 N008 N007 2m Rser=1m
L1_f2 N019 N018 2m Rser=1m
L1_f3 N028 N027 2m Rser=1m
C5 N007 N018 50n Rser=0.01m
C6 N018 N027 50n Rser=0.01m
C7 N007 N027 50n Rser=0.01m
C8 N008 N019 50n Rser=0.01m
C9 N019 N028 50n Rser=0.01m
C10 N008 N028 50n Rser=0.01m
C11 N008 0 2n Rser=0.001m
C12 N019 0 2n Rser=0.001m
C13 N028 0 2n Rser=0.001m
R20 N003 N008 0.05
R21 N004 N019 0.05
R22 N005 N028 0.05
R4 N015 N026 1m
R23 N026 0 1m
R24 N029 0 1m
R28 P004 N009 10
R29 P005 N009 10
V4 N009 Vin PULSE(0 12 50m 0.1m 0 1 1)
R26 N002 Vin 50
Lr1 N013 A 10µ Rser=0.01m
C27 N014 N013 250n Rser=0.01m
L§TR1_P C N014 50µ Rser=0.01m
L§TR1_S1 C N017 3.725µ Rser=1m
C28 N021 C 560µ V=50 Rser=15m Lser=10n
R_yuk Vout C 1
L§TR1_S2 N025 C 3.725µ Rser=1m
R14 N010 N016 22
R15 N024 N023 22
M1 N006 N010 A A MY_MOS
M2 A N024 C C MY_MOS
M3 N002 P005 Vin Vin R6020PNJ
M4 N002 P004 Vin Vin R6020PNJ
C1 N012 P006 560µ V=50 Rser=15m Lser=10n
C16 N020 C 560µ V=50 Rser=15m Lser=10n
C23 N012 P007 560µ V=50 Rser=15m Lser=10n
C34 N012 C 10µ Rser=1m Lser=0.1n
C35 N012 C 10µ Rser=1m Lser=0.1n
C36 N012 C 10µ Rser=1m Lser=0.1n
C37 N012 C 10µ Rser=1m Lser=0.1n
C40 N011 N017 100p
C41 N011 N025 100p
D7 N017 N011 SiC_Test
D14 N025 N011 SiC_Test
C42 N012 C 10µ Rser=1m Lser=0.1n
C43 N012 C 10µ Rser=1m Lser=0.1n
C44 N012 C 10µ Rser=1m Lser=0.1n
C45 N012 C 10µ Rser=1m Lser=0.1n
C30 P007 N020 560µ V=50 Rser=15m Lser=10n
C31 P006 N021 560µ V=50 Rser=15m Lser=10n
C2 Vin C 100µ V=450 Rser=10m
L1 N001 N002 2m Rser=50m
V5 N016 A PULSE(0 12 100m 10n 10n 4.5u 10u)
V6 N023 C PULSE(0 12 {delay} 10n 10n 4.5u 10u)
C21 N012 C 1µ Rser=1m
C17 N012 C 1µ Rser=1m
C18 N012 C 1µ Rser=1m
C19 N012 C 1µ Rser=1m
C20 N012 C 1µ Rser=1m
C22 N012 C 1µ Rser=1m
L2 N011 N012 2µ Rser=40m
R_meas Vin N006 0.0001
C15 N022 C 560µ V=50 Rser=15m Lser=10n
C24 N012 P008 560µ V=50 Rser=15m Lser=10n
C25 P008 N022 560µ V=50 Rser=15m Lser=10n
L3 N012 Vout 1µ Rser=1m
C3 Vout C 50n Rser=0.01m
C4 Vout C 100n Rser=0.01m
C14 Vout C 25n Rser=0.01m
C26 Vin 0 2n
C29 0 C 2n
C32 N011 0 2n
C33 0 C 2n
R1 N011 N017 0.01
R2 N011 N025 0.01
.model D D
.lib standard.dio
.model NMOS NMOS
.model PMOS PMOS
.lib standard.mos
* Fuse
* 3-Phase 115VAC RMS 400HZ
.model MY_VAR D(Is=1n Rs=0.01 Bv=350 Ibv=1m)
* VARISTOR
.tran 0 150m 0m uic
K1 L1_f1 L1_f2 L1_f3 0.999
* CMC 1
* X Caps
* X Caps
* Y Caps
* Pi Filter
K3 TR1_P TR1_S1 TR1_S2 0.999
.options cshunt=1e-15 gmin=1e-10
.options reltol=0.01 vntol=1m abstol=1n
* Soft Starter
* Lm1
* Frl= 100Khz , Fs =100Khz , tdead = 0.5u
.param delay={100m + 5u}
.measure TRAN Pgiris AVG (V(L1)*I(V1) + V(L2)*I(V2) + V(L3)*I(V3))
.measure TRAN Va_rms RMS V(L1)
.measure TRAN Ia_rms RMS I(V1)
.measure TRAN Vb_rms RMS V(L2)
.measure TRAN Ib_rms RMS I(V2)
.measure TRAN Vc_rms RMS V(L3)
.measure TRAN Ic_rms RMS I(V3)
.measure TRAN Sgiris param (Va_rms*Ia_rms + Vb_rms*Ib_rms + Vc_rms*Ic_rms)
.measure TRAN Qgiris param sqrt(abs(Sgiris**2 - Pgiris**2))
.measure TRAN PowerFactor param abs(Pgiris / Sgiris)
.model SiC_Test D(Is=1e-18 N=1.1 Rs=8m Cjo=800p M=0.5 Vj=1.3 Bv=650)
* EEU-FR1H561B
.model MY_MOS VDMOS(Rg=19.5 Vto=4.486 Rd=85m Rs=15m Rb=15m Kp=39.78 Lambda=50m Cgdmin=13p Cgdmax=3.5n A=1.2 Cgso=1.97n Is=581.06p N=1.245 Cjo=6.7667n M=900.62m Vj=2.19 TT=680n ksubthres=.1 mfg=Rohm Vds=600 Ron=50m Qg=65n)
* PULSE(0 12 {delay} 10n 10n 4.5u 10u)
.measure TRAN Pyuk AVG (V(Vout,C)*I(R_yuk))
.measure TRAN Efficiency param ((Pyuk / Pvin)*100)
.measure TRAN Pvin AVG (V(Vin,B)*I(R_meas))
* Bulk
.model STTH30R06 D(Is=125n Rs=0.016 N=2.1 Bv=600 Ibv=1m Cjo=155p Tt=45n)
* Y-Caps
.backanno
.end